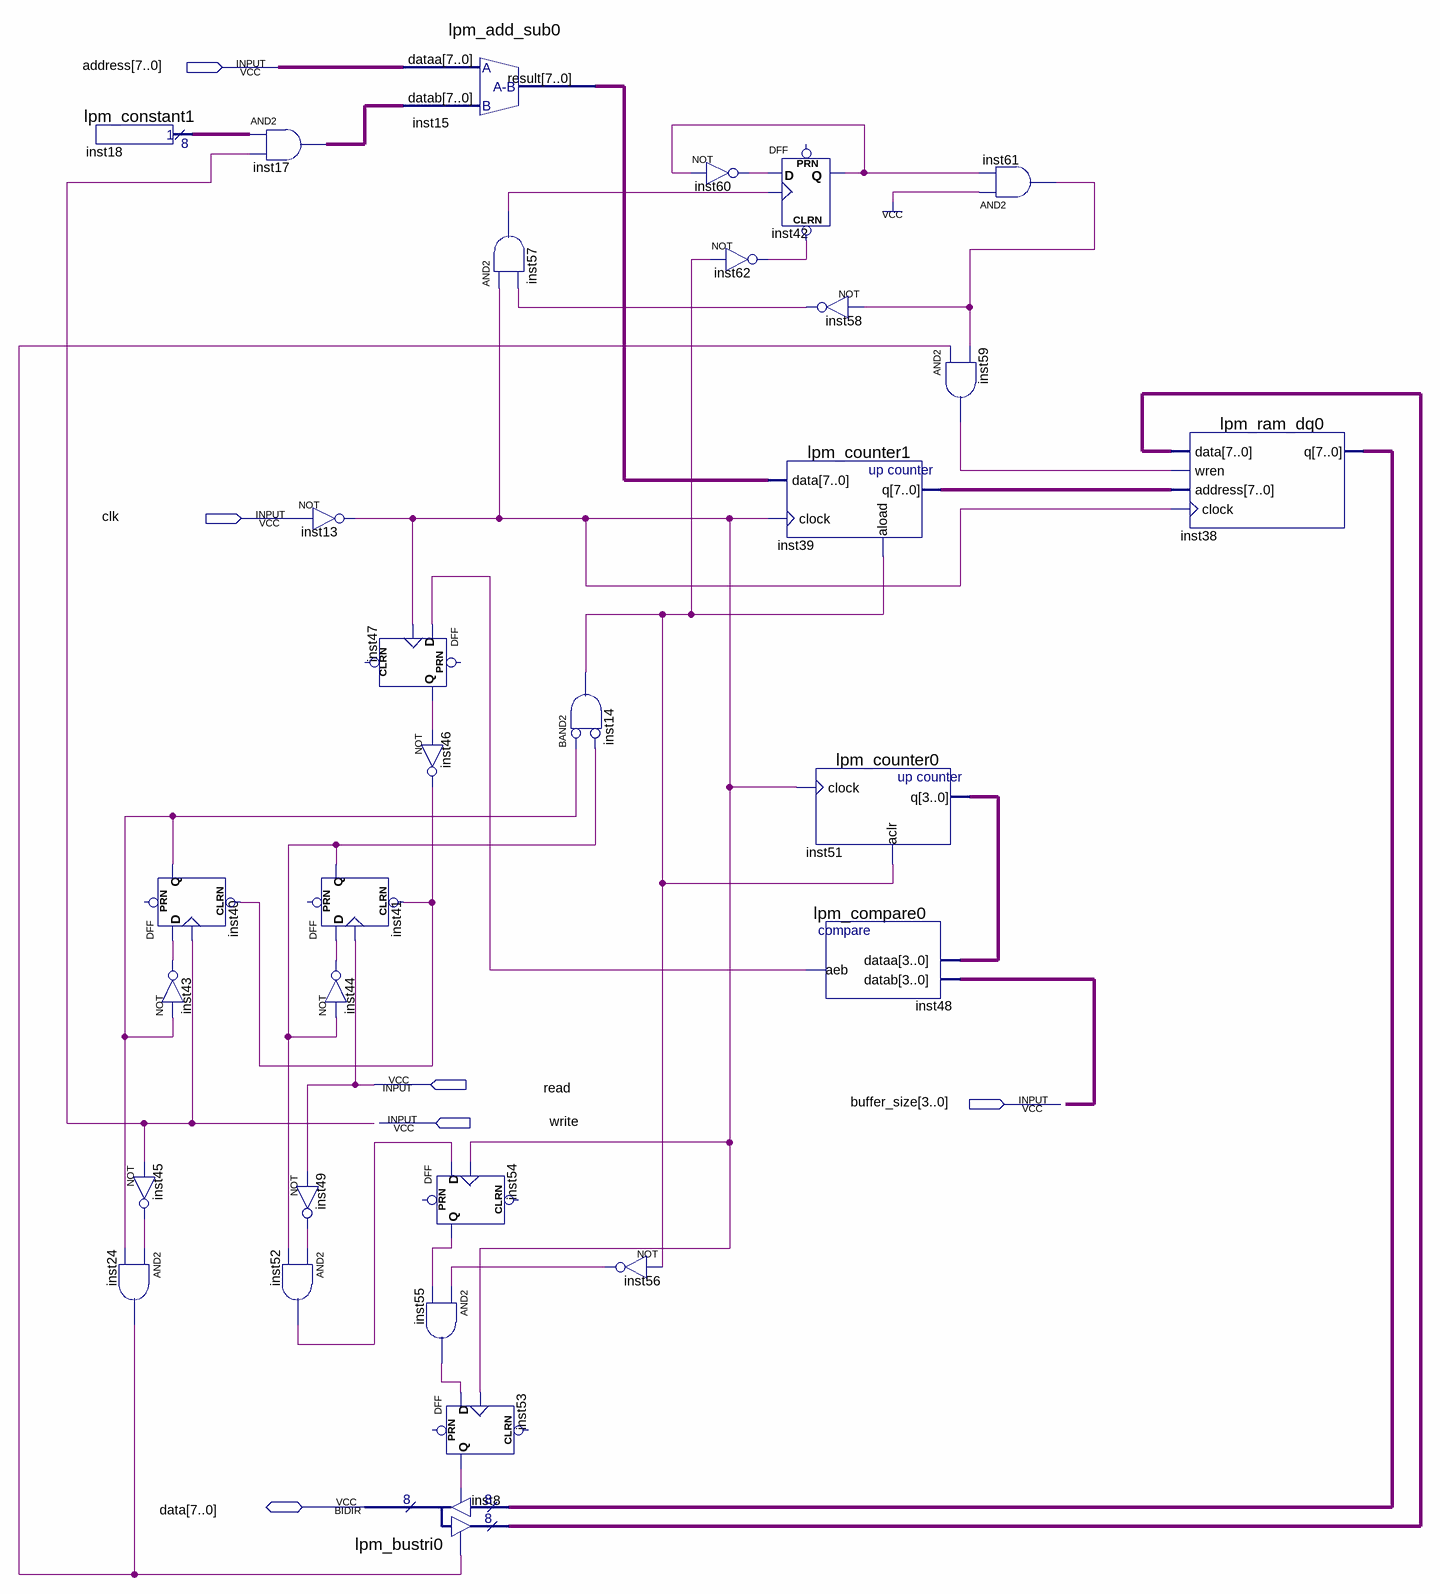
[diagram p0: schematic sheet]
// Quartus schematic RAM.bdf as structural Verilog: 31 symbols, 6 pins
module RAM (
  input  [7:0] address,
  input  clk,
  input  read,
  input  [3:0] buffer_size,
  input  write,
  inout  [7:0] data
);

  wire inst13_out, inst14_out, inst24_out, inst40_q, inst41_q, inst42_q, inst43_out, inst44_out, inst45_out,
       inst46_out, inst47_q, inst48_aeb, inst49_out, inst52_out, inst53_q, inst54_q, inst55_out, inst56_out,
       inst57_out, inst58_out, inst59_out, inst60_out, inst61_out, inst62_out;
  wire [3:0] inst51_q;
  wire [7:0] inst8_result, inst15_result, inst17_out, inst18_result, inst38_q, inst39_q;

  lpm_constant1 inst18 (.result(inst18_result));
  not inst45 (inst45_out, write);
  and inst24 (inst24_out, inst45_out, inst40_q);
  DFF inst40 (.CLRN(inst46_out), .CLK(write), .D(inst43_out), .Q(inst40_q));  // open: PRN
  not inst43 (inst43_out, inst40_q);
  assign inst17_out = inst18_result & {8{write}};  // AND2 inst17, 8 bits wide
  and inst52 (inst52_out, inst49_out, inst41_q);
  not inst13 (inst13_out, clk);
  DFF inst41 (.CLRN(inst46_out), .CLK(read), .D(inst44_out), .Q(inst41_q));  // open: PRN
  not inst44 (inst44_out, inst41_q);
  not inst49 (inst49_out, read);
  lpm_add_sub0 inst15 (.dataa(address), .datab(inst17_out), .result(inst15_result));
  DFF inst47 (.CLK(inst13_out), .D(inst48_aeb), .Q(inst47_q));  // open: CLRN, PRN
  not inst46 (inst46_out, inst47_q);
  DFF inst54 (.CLK(inst13_out), .D(inst52_out), .Q(inst54_q));  // open: CLRN, PRN
  and inst55 (inst55_out, inst56_out, inst54_q);
  DFF inst53 (.CLK(inst13_out), .D(inst55_out), .Q(inst53_q));  // open: CLRN, PRN
  lpm_bustri0 inst8 (
    .enabledt(inst53_q), .data(inst38_q), .enabletr(inst24_out), .result(inst8_result), .tridata(data));
  and inst57 (inst57_out, inst13_out, inst58_out);
  and inst14 (inst14_out, ~inst40_q, ~inst41_q);  // BAND2
  not inst56 (inst56_out, inst14_out);
  not inst60 (inst60_out, inst42_q);
  not inst62 (inst62_out, inst14_out);
  DFF inst42 (.CLRN(inst62_out), .CLK(inst57_out), .D(inst60_out), .Q(inst42_q));  // open: PRN
  not inst58 (inst58_out, inst61_out);
  lpm_counter1 inst39 (.data(inst15_result), .clock(inst13_out), .aload(inst14_out), .q(inst39_q));
  lpm_counter0 inst51 (.clock(inst13_out), .aclr(inst14_out), .q(inst51_q));
  lpm_compare0 inst48 (.dataa(inst51_q), .datab(buffer_size), .aeb(inst48_aeb));
  and inst59 (inst59_out, inst24_out, inst61_out);
  and inst61 (inst61_out, 1'b1, inst42_q);
  lpm_ram_dq0 inst38 (.data(inst8_result), .wren(inst59_out), .address(inst39_q), .clock(inst13_out), .q(inst38_q));
endmodule
